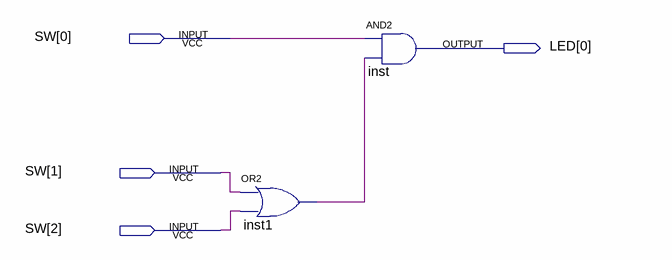
[diagram p0: schematic sheet]
// Quartus schematic ex2.bdf as structural Verilog: 2 symbols, 4 pins
module ex2 (
  input  [2:0] SW,
  output [0:0] LED
);

  wire inst1_out;

  or inst1 (inst1_out, SW[1], SW[2]);
  and inst (LED[0], SW[0], inst1_out);
endmodule
